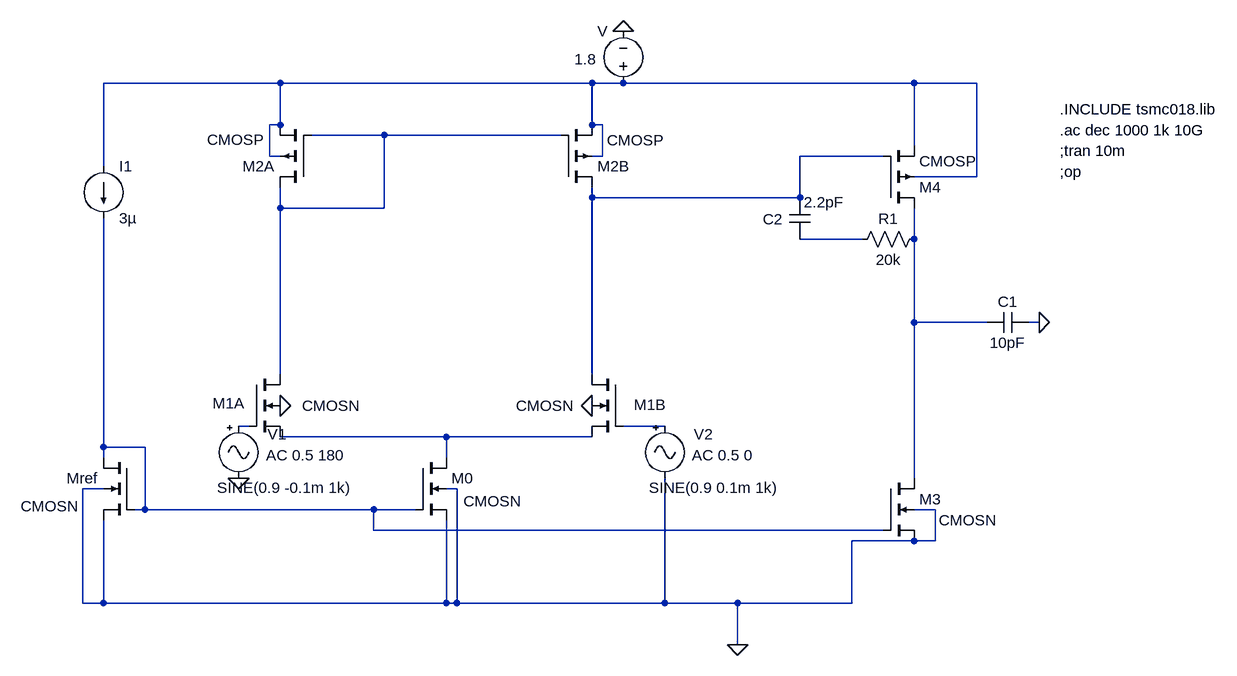
[diagram p0: schematic open_loop.asc]
open_loop.asc, the LTspice schematic file:
Version 4
SHEET 1 880 680
WIRE -688 -448 -960 -448
WIRE -256 -448 -688 -448
WIRE -208 -448 -256 -448
WIRE -160 -448 -208 -448
WIRE 288 -448 -160 -448
WIRE 384 -448 288 -448
WIRE -688 -384 -688 -448
WIRE -688 -384 -704 -384
WIRE -208 -384 -208 -448
WIRE -192 -384 -208 -384
WIRE -528 -368 -640 -368
WIRE -400 -368 -528 -368
WIRE -256 -368 -400 -368
WIRE 288 -352 288 -448
WIRE -704 -336 -704 -384
WIRE -688 -336 -704 -336
WIRE -192 -336 -192 -384
WIRE -192 -336 -208 -336
WIRE 240 -336 112 -336
WIRE -960 -320 -960 -448
WIRE 384 -304 384 -448
WIRE 384 -304 288 -304
WIRE -208 -272 -208 -288
WIRE -48 -272 -208 -272
WIRE 112 -272 112 -336
WIRE 112 -272 -48 -272
WIRE -688 -256 -688 -288
WIRE -608 -256 -688 -256
WIRE -528 -256 -528 -368
WIRE -528 -256 -608 -256
WIRE -208 -224 -208 -272
WIRE 208 -208 112 -208
WIRE 288 -208 288 -256
WIRE 288 -80 288 -208
WIRE 400 -80 288 -80
WIRE 480 -80 464 -80
WIRE -688 0 -688 -256
WIRE -208 0 -208 -224
WIRE -736 80 -752 80
WIRE -96 80 -160 80
WIRE -432 96 -688 96
WIRE -416 96 -432 96
WIRE -208 96 -416 96
WIRE -960 112 -960 -240
WIRE -896 112 -960 112
WIRE -960 128 -960 112
WIRE -432 128 -432 96
WIRE 288 160 288 -80
WIRE -960 176 -992 176
WIRE -416 176 -432 176
WIRE -896 208 -896 112
WIRE -896 208 -912 208
WIRE -544 208 -896 208
WIRE -480 208 -544 208
WIRE 320 208 288 208
WIRE -544 240 -544 208
WIRE -224 240 -544 240
WIRE 240 240 -224 240
WIRE 288 256 192 256
WIRE 320 256 320 208
WIRE 320 256 288 256
WIRE -992 352 -992 176
WIRE -960 352 -960 224
WIRE -960 352 -992 352
WIRE -432 352 -432 224
WIRE -432 352 -960 352
WIRE -416 352 -416 176
WIRE -416 352 -432 352
WIRE -96 352 -96 160
WIRE -96 352 -416 352
WIRE 16 352 -96 352
WIRE 192 352 192 256
WIRE 192 352 16 352
WIRE 16 416 16 352
FLAG -160 -528 0
FLAG -688 48 0
FLAG 480 -80 0
FLAG -208 48 0
FLAG 16 416 0
FLAG -752 160 0
DATAFLAG -256 -448 ""
DATAFLAG -608 -256 ""
DATAFLAG -416 96 ""
DATAFLAG -48 -272 ""
DATAFLAG -224 240 ""
DATAFLAG -400 -368 ""
DATAFLAG -208 -224 ""
SYMBOL cmosn -912 128 M0
WINDOW 3 86 75 Left 2
SYMATTR InstName Mref
SYMATTR Value2 l=1u w=2u
SYMBOL current -960 -320 R0
WINDOW 123 0 0 Left 2
WINDOW 39 0 0 Left 2
SYMATTR InstName I1
SYMATTR Value 3µ
SYMBOL cmosn -480 128 R0
WINDOW 3 74 67 Left 2
SYMATTR InstName M0
SYMATTR Value2 l=1u w=21u
SYMBOL cmosn -736 0 R0
WINDOW 3 82 48 Left 2
WINDOW 0 -56 44 Left 2
SYMATTR InstName M1A
SYMATTR Value2 l=1u w=13.04u
SYMBOL cmosp -256 -288 M180
WINDOW 3 71 72 Left 2
SYMATTR InstName M2B
SYMATTR Value2 l=1u w=4u
SYMBOL cmosp -640 -288 R180
WINDOW 3 73 73 Left 2
SYMATTR InstName M2A
SYMATTR Value2 l=1u w=4u
SYMBOL voltage -160 -432 R180
WINDOW 0 24 96 Left 2
WINDOW 3 41 53 Left 2
WINDOW 123 0 0 Left 2
WINDOW 39 0 0 Left 2
SYMATTR InstName V
SYMATTR Value 1.8
SYMBOL cmosp 240 -256 M180
SYMATTR InstName M4
SYMATTR Value2 l=1u w=8u
SYMBOL cmosn 240 160 R0
WINDOW 3 86 64 Left 2
SYMATTR InstName M3
SYMATTR Value2 l=1u w=20u
SYMBOL Misc\\signal -96 64 R0
WINDOW 123 42 60 Left 2
WINDOW 39 0 0 Left 2
WINDOW 0 45 28 Left 2
WINDOW 3 174 110 Right 2
SYMATTR Value2 AC 0.5 0
SYMATTR InstName V2
SYMATTR Value SINE(0.9 0.1m 1k)
SYMBOL cap 464 -96 R90
WINDOW 0 0 32 VBottom 2
WINDOW 3 32 32 VTop 2
SYMATTR InstName C1
SYMATTR Value 10pF
SYMBOL cap 96 -272 R0
WINDOW 0 -41 33 Left 2
WINDOW 3 22 7 Left 2
SYMATTR InstName C2
SYMATTR Value 2.2pF
SYMBOL res 304 -224 R90
WINDOW 0 0 56 VBottom 2
WINDOW 3 32 56 VTop 2
SYMATTR InstName R1
SYMATTR Value 20k
SYMBOL cmosn -160 0 M0
WINDOW 3 76 48 Left 2
WINDOW 0 -66 47 Left 2
SYMATTR InstName M1B
SYMATTR Value2 l=1u w=13.04u
SYMBOL Misc\\signal -752 64 R0
WINDOW 123 42 60 Left 2
WINDOW 39 0 0 Left 2
WINDOW 0 45 28 Left 2
WINDOW 3 174 110 Right 2
SYMATTR Value2 AC 0.5 180
SYMATTR InstName V1
SYMATTR Value SINE(0.9 -0.1m 1k)
TEXT 512 -408 Left 2 !.INCLUDE tsmc018.lib
TEXT 512 -344 Left 2 !;tran 10m
TEXT 512 -376 Left 2 !.ac dec 1000 1k 10G
TEXT 512 -312 Left 2 !;op

The netlist it stands for:
* open_loop.asc
Mref N009 N009 0 0 CMOSN l=1u w=2u
I1 N001 N009 3µ
M0 N008 N009 0 0 CMOSN l=1u w=21u
M1A N002 N006 N008 0 CMOSN l=1u w=13.04u
M2B N003 N002 N001 N001 CMOSP l=1u w=4u
M2A N002 N002 N001 N001 CMOSP l=1u w=4u
V N001 0 1.8
M4 N005 N003 N001 N001 CMOSP l=1u w=8u
M3 N005 N009 0 0 CMOSN l=1u w=20u
V2 N007 0 SINE(0.9 0.1m 1k) AC 0.5 0
C1 0 N005 10pF
C2 N003 N004 2.2pF
R1 N005 N004 20k
M1B N003 N007 N008 0 CMOSN l=1u w=13.04u
V1 N006 0 SINE(0.9 -0.1m 1k) AC 0.5 180
.model NMOS NMOS
.model PMOS PMOS
.lib standard.mos
.INCLUDE tsmc018.lib
;tran 10m
.ac dec 1000 1k 10G
;op
.backanno
.end